# EAGLE design tick-wifi-mini-mk-1.0 (EAGLE 7.5.0)
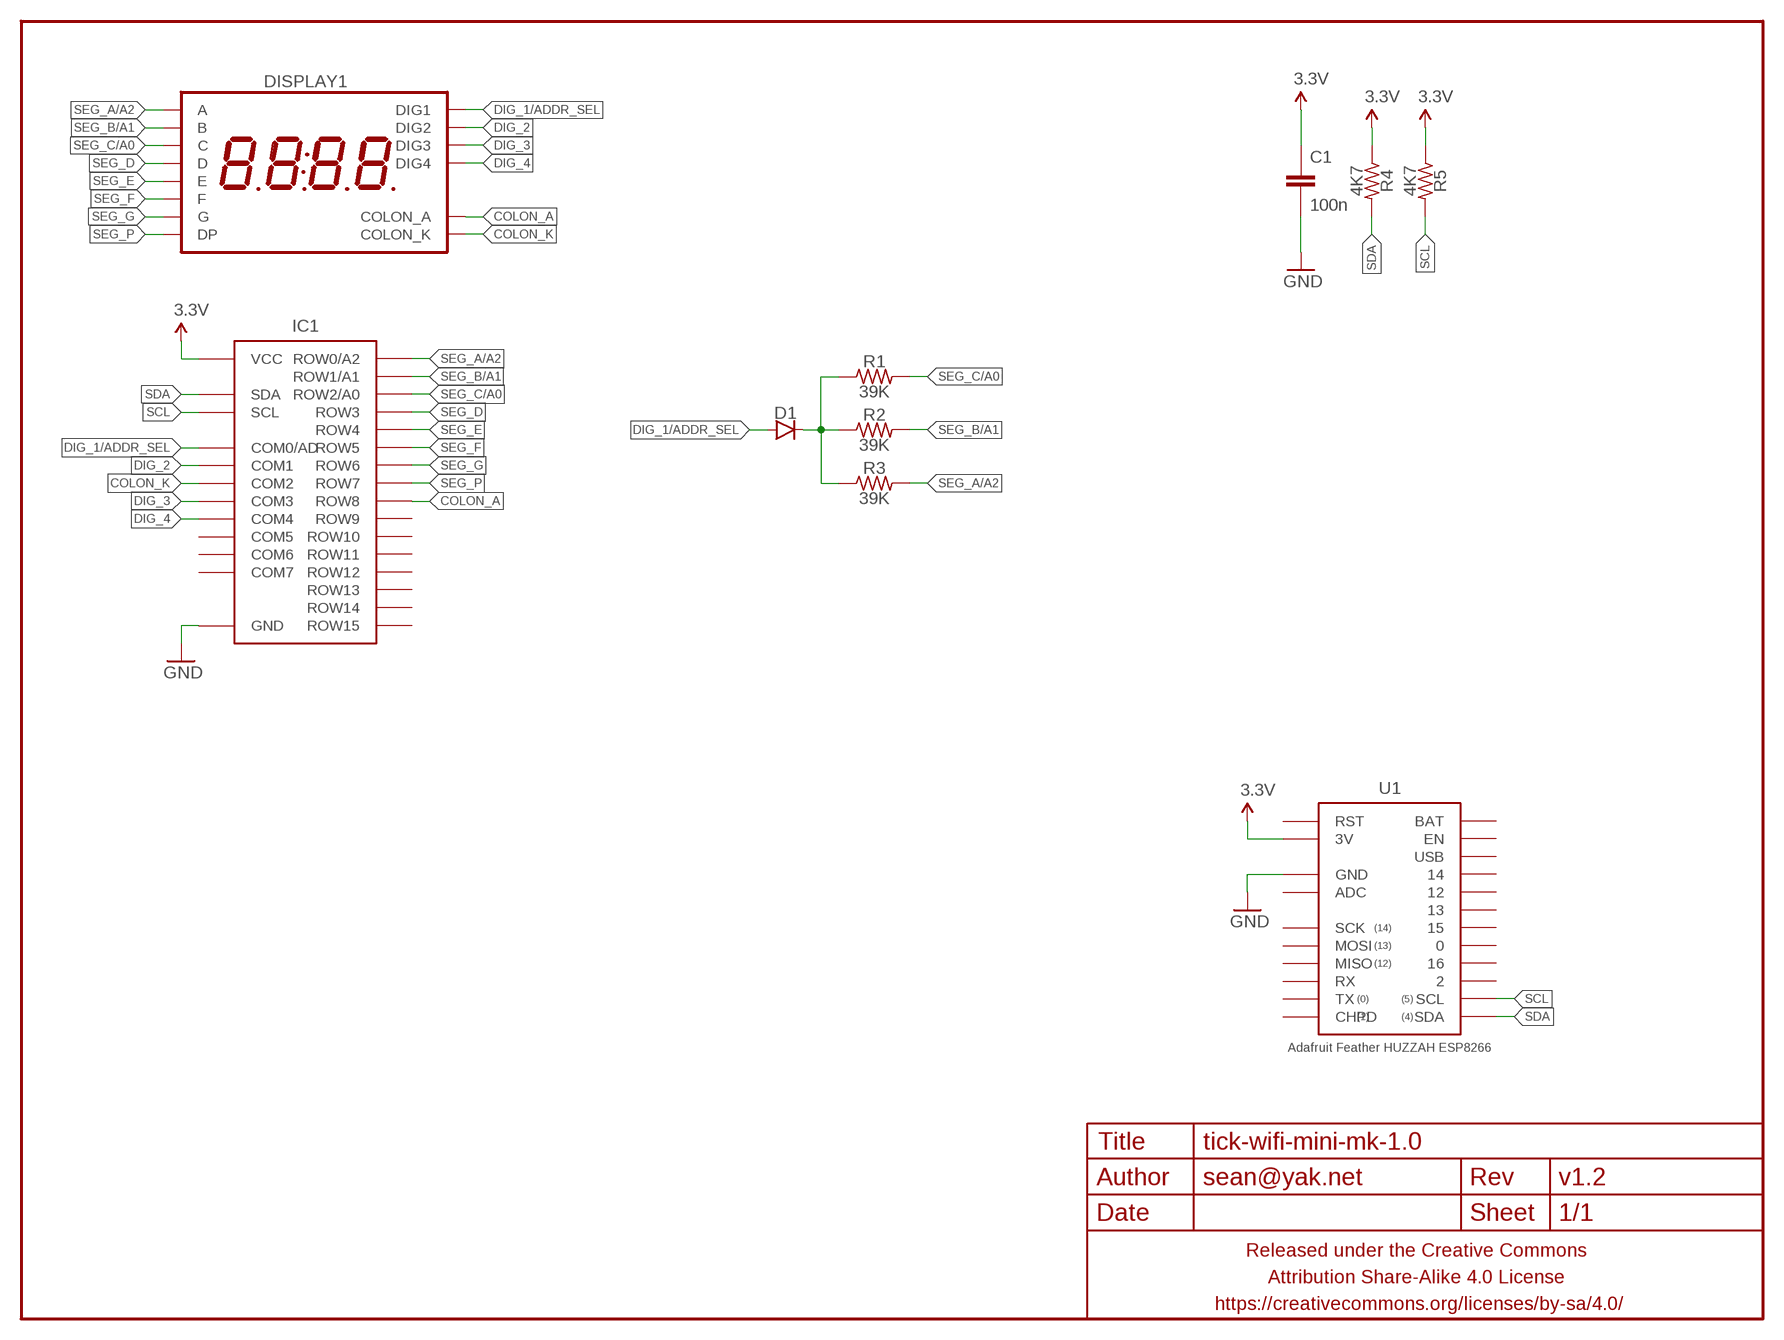
[diagram p0: schematic, sheet 1]

## Parts
C1  100n  CAPACITOR-CERAMICC0603  [C0603]
D1  DIODESOD123  [SOD123]
DISPLAY1  7SEG_4DIGIT_COLON14.2MM-CC  [7SEG_4DIG_0.56IN_14MM_ADAFRUIT]
FRAME1  FRAME-LETTERNO_PACKAGE  [DUMMY]
IC1  HT16K33  HT16K33-28SOIC28W  [SOIC28W]
R1  39K  RESISTORR0603  [R0603]
R2  39K  RESISTORR0603  [R0603]
R3  39K  RESISTORR0603  [R0603]
R4  4K7  RESISTORR0603  [R0603]
R5  4K7  RESISTORR0603  [R0603]
U1  Adafruit Feather HUZZAH ESP8266  ADAFRUIT_FEATHER_HUZZAH_ESP8266NOSILK  [ADAFRUIT_FEATHER_HUZZAH_NOSILK]

## Nets
3.3V: C1.1 IC1.28(VCC) R4.1 R5.1 U1.3V
COLON_A: DISPLAY1.P$8(COLON_A) IC1.17(ROW8)
COLON_K: DISPLAY1.P$7(COLON_K) IC1.4(COM2)
DIG_1/ADDR_SEL: D1.A DISPLAY1.P$14(DIG1) IC1.2(COM0/AD)
DIG_2: DISPLAY1.P$11(DIG2) IC1.3(COM1)
DIG_3: DISPLAY1.P$10(DIG3) IC1.5(COM3)
DIG_4: DISPLAY1.P$6(DIG4) IC1.6(COM4)
GND: C1.2 IC1.1(GND) U1.GND@0(GND)
N$1: D1.C R1.1 R2.1 R3.1
SCL: IC1.26(SCL) R5.2 U1.SCL
SDA: IC1.27(SDA) R4.2 U1.SDA
SEG_A/A2: DISPLAY1.P$13(A) IC1.25(ROW0/A2) R3.2
SEG_B/A1: DISPLAY1.P$9(B) IC1.24(ROW1/A1) R2.2
SEG_C/A0: DISPLAY1.P$4(C) IC1.23(ROW2/A0) R1.2
SEG_D: DISPLAY1.P$2(D) IC1.22(ROW3)
SEG_E: DISPLAY1.P$1(E) IC1.21(ROW4)
SEG_F: DISPLAY1.P$12(F) IC1.20(ROW5)
SEG_G: DISPLAY1.P$5(G) IC1.19(ROW6)
SEG_P: DISPLAY1.P$3(DP) IC1.18(ROW7)
Unconnected: IC1.7(COM5) IC1.8(COM6) IC1.9(COM7) IC1.10(ROW15) IC1.11(ROW14) IC1.12(ROW13) IC1.13(ROW12) IC1.14(ROW11) IC1.15(ROW10) IC1.16(ROW9) U1.0 U1.2 U1.12 U1.13 U1.14 U1.15 U1.16 U1.ADC U1.BAT U1.CHPD U1.EN U1.MISO U1.MOSI U1.RST U1.RX U1.SCK U1.TX U1.USB

## Library data of the parts
C1 = a_parts:CAPACITOR-CERAMIC: CAPACITOR, European symbol
D1 = a_parts:DIODE: Diode These are standard reverse protection diodes and small signal diodes. SMA package can handle up to about 1A. SOD-323 can handle about 200mA. What the SOD-323 package when ordering, there are some mfgs out there that are 5-pin packages.
DISPLAY1 = a_parts:7SEG_4DIGIT_COLON
FRAME1 = A_butts:FRAME-LETTER: Schematic Frame Standard 8.5x11 US Letter frame; DESIGNER: sean@yak.net; VERSION: v1.2
IC1 = a_parts:HT16K33-28
R1-R5 = a_parts:RESISTOR: RESISTOR, American symbol
U1 = a_parts:ADAFRUIT_FEATHER_HUZZAH_ESP8266

## Board
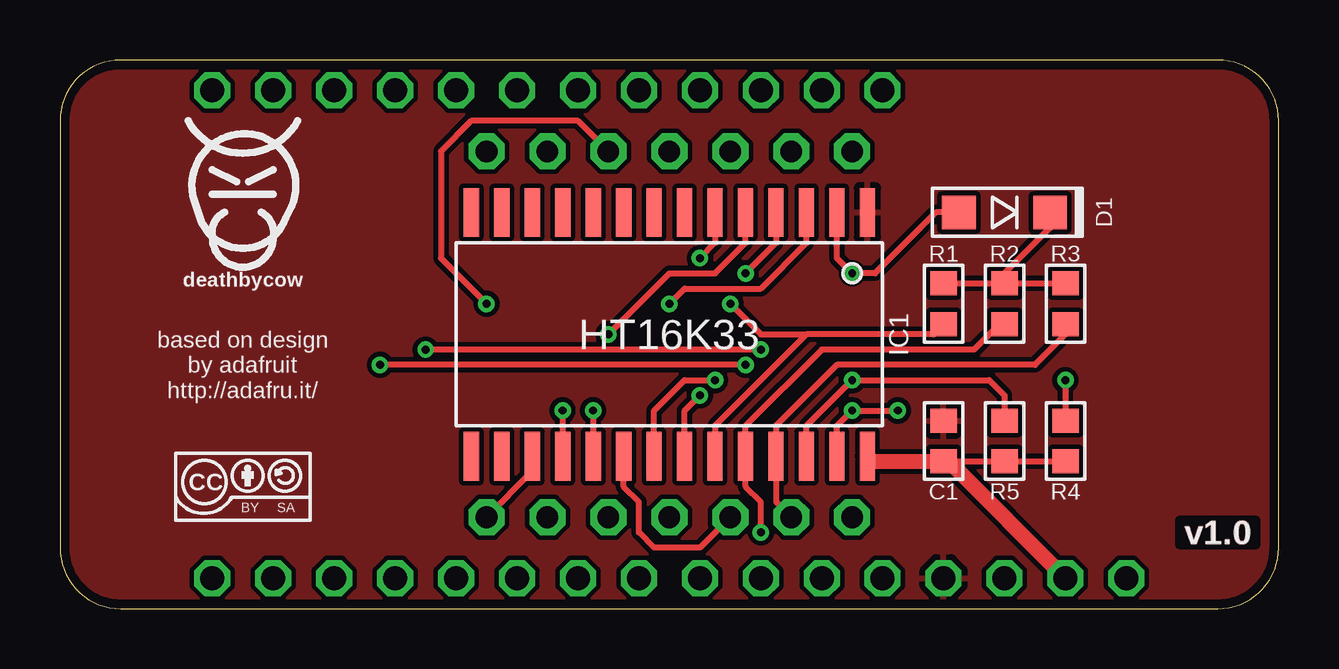
[diagram p1: board, top side]
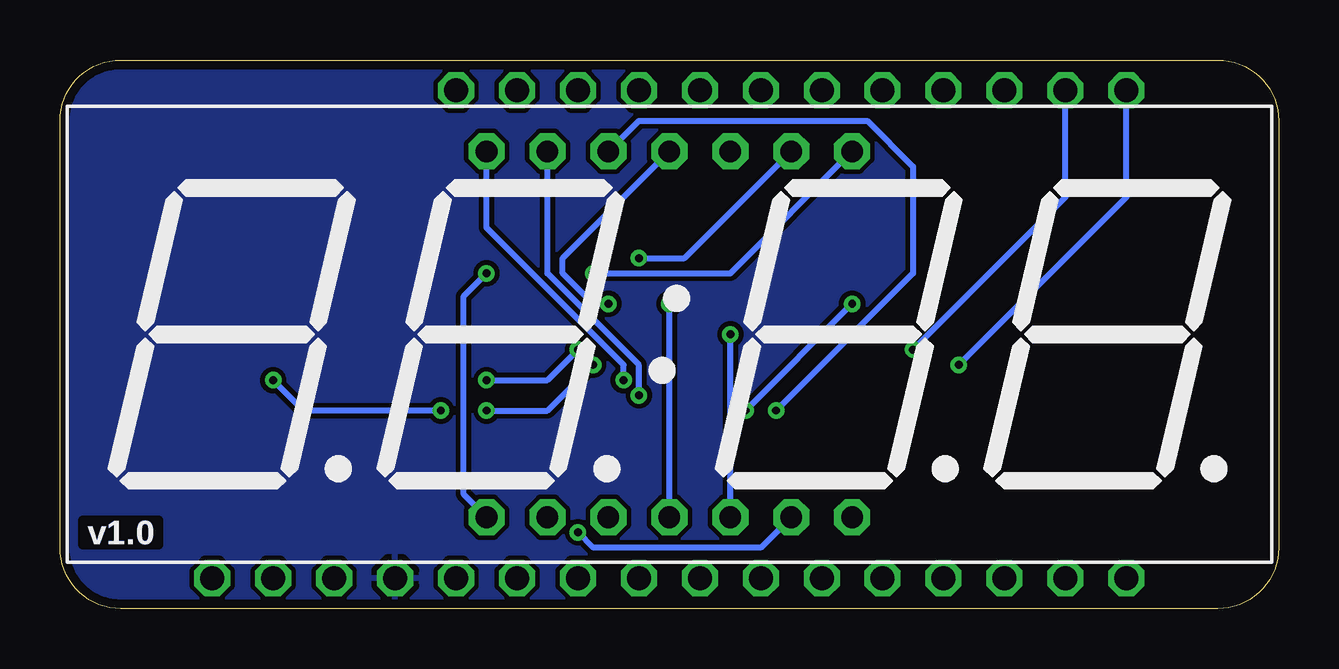
[diagram p2: board, bottom side, seen from below]

Size 50.8 x 22.86 mm. Coordinates in mm from the lower left corner, seen from the top.
Outline: 0,20.32 0,2.54 arc90 2.54,0 48.26,0 arc90 50.8,2.54 50.8,20.32 arc90 48.26,22.86 2.54,22.86 arc90 0,20.32
Copper layers (1*16): Top 0.0356mm / dielectric 1.5011mm / Bottom 0.0356mm
Design rules "LaenPCBOrder_2": minimum track width 6mil, minimum drill 13mil, track to track 6mil, track to pad 6mil, pad to pad 6mil, via to via 6mil, smd to smd 6mil, copper to edge 15mil, drill to drill 6mil, minimum pad ring 7mil, minimum via ring 7mil, stop-mask expansion 3mil, vias tented up to drill 20mil, thermal gap 10mil

### Footprints (pad centres in the part's own frame; a part is rotated, then mirrored left to right if it is on the bottom)
C0603 = smd 1 x 1.1: 1 -0.85,0; 2 0.85,0
SOD123 = smd 1.4 x 1.4: A 1.9,0; C -1.9,0
7SEG_4DIG_0.56IN_14MM_ADAFRUIT = drill 0.9 pad 1.5 octagon: P$1 -7.62,7.62; P$2 -5.08,7.62; P$3 -2.54,7.62; P$4 0,7.62; P$5 2.54,7.62; P$6 5.08,7.62; P$7 7.62,7.62; P$8 7.62,-7.62; P$9 5.08,-7.62; P$10 2.54,-7.62; P$11 0,-7.62; P$12 -2.54,-7.62; P$13 -5.08,-7.62; P$14 -7.62,-7.62
SOIC28W = smd 0.635 x 2.032: 1 -8.255,-5.08; 2 -6.985,-5.08; 3 -5.715,-5.08; 4 -4.445,-5.08; 5 -3.175,-5.08; 6 -1.905,-5.08; 7 -0.635,-5.08; 8 0.635,-5.08; 9 1.905,-5.08; 10 3.175,-5.08; 11 4.445,-5.08; 12 5.715,-5.08; 13 6.985,-5.08; 14 8.255,-5.08; 15 8.255,5.08; 16 6.985,5.08; 17 5.715,5.08; 18 4.445,5.08; 19 3.175,5.08; 20 1.905,5.08; 21 0.635,5.08; 22 -0.635,5.08; 23 -1.905,5.08; 24 -3.175,5.08; 25 -4.445,5.08; 26 -5.715,5.08; 27 -6.985,5.08; 28 -8.255,5.08
R0603 = smd 1 x 1.1: 1 -0.85,0; 2 0.85,0
ADAFRUIT_FEATHER_HUZZAH_NOSILK = drill 1 pad 1.5 octagon: 0 8.89,10.16; 2 13.97,10.16; 3V -16.51,-10.16; 12 1.27,10.16; 13 3.81,10.16; 14 -1.27,10.16; 15 6.35,10.16; 16 11.43,10.16; ADC -8.89,-10.16; BAT -8.89,10.16; CHPD 19.05,-10.16; EN -6.35,10.16; GND@0 -11.43,-10.16; MISO 11.43,-10.16; MOSI 8.89,-10.16; NC@3 -13.97,-10.16; NC@6 -6.35,-10.16; NC@7 -3.81,-10.16; NC@8 -1.27,-10.16; NC@9 1.27,-10.16; NC@10 3.81,-10.16; RST -19.05,-10.16; RX 13.97,-10.16; SCK 6.35,-10.16; SCL 16.51,10.16; SDA 19.05,10.16; TX 16.51,-10.16; USB -3.81,10.16

### Placement (x,y rotation side)
C1  36.83,6.99 90 top
D1  39.37,16.51 180 top
DISPLAY1  25.4,11.43 0 bottom
FRAME1  0,0 0 top
IC1  25.4,11.43 180 top
R1  36.83,12.7 270 top
R2  39.37,12.7 270 top
R3  41.91,12.7 270 top
R4  41.91,6.99 90 top
R5  39.37,6.99 90 top
U1  25.4,11.43 0 bottom
U$2  [COW_SMALL]  7.62,17.78 0 top
U$4  [CC-BY-SA-4.0-NO-URL]  7.62,5.08 0 top

### Tracks (layer width: path | path; a pad name or v marks a point on that pad's centre or on a via)
3.3V
  Top 0.254: 37.05,6.13 R5.1 R4.1
  Top 0.635: IC1.28 33.87,6.13 C1.1 37.05,6.13 U1.3V
COLON_A
  Top 0.254: IC1.17 19.68,5.71 DISPLAY1.P$8
COLON_K  (via drill 0.33)
  Top 0.254: IC1.4 29.84,15.24 v28.57,13.97
  Bottom 0.254: v28.57,13.97 22.86,13.97 DISPLAY1.P$7
DIG_1/ADDR_SEL  (via drill 0.33)
  Top 0.254: IC1.2 32.38,14.61 v33.02,13.97 33.97,13.97 36.51,16.51 D1.A
  Bottom 0.254: DISPLAY1.P$14 33.97,4.76 33.97,13.02 v33.02,13.97
DIG_2  (via drill 0.33)
  Top 0.254: v25.4,12.7 26.04,13.34 29.21,13.34 31.11,15.24 IC1.3
  Bottom 0.254: DISPLAY1.P$11 v25.4,12.7
DIG_3  (via drill 0.33)
  Top 0.254: v22.86,11.43 25.4,13.97 27.3,13.97 28.57,15.24 IC1.5
  Bottom 0.254: DISPLAY1.P$10 v22.86,11.43
DIG_4  (via drill 0.33)
  Top 0.254: IC1.6 27.3,15.24 v26.67,14.61
  Bottom 0.254: v26.67,14.61 24.77,14.61 DISPLAY1.P$6
GND
  pour Top (isolate 0.2): 48.26,0 2.54,0 arc-90 0,2.54 0,20.32 arc-90 2.54,22.86 48.26,22.86 arc-90 50.8,20.32 50.8,2.54 arc-90
  pour Bottom (isolate 0.2): 48.26,0 2.54,0 arc-90 0,2.54 0,20.32 arc-90 2.54,22.86 48.26,22.86 arc-90 50.8,20.32 50.8,2.54 arc-90
N$1
  Top 0.254: R1.1 R2.1 | R2.1 R3.1 | D1.C 41.27,15.87 39.37,13.97 R2.1
SCL  (via drill 0.33)
  Top 0.254: IC1.26 31.11,7.62 v33.02,9.53 38.73,9.53 39.37,8.89 R5.2 | v29.21,10.79 v15.24,10.79
  Bottom 0.254: v33.02,9.53 30.48,9.53 v29.21,10.79 | v15.24,10.79 8.89,17.14 U1.SCL
SDA  (via drill 0.33)
  Top 0.254: IC1.27 32.38,7.62 v33.02,8.26 v34.92,8.26 | v41.91,9.53 R4.2 | v28.57,10.16 v13.34,10.16
  Bottom 0.254: v34.92,8.26 40.64,8.26 v41.91,9.53 | v13.34,10.16 6.35,17.14 U1.SDA | v33.02,8.26 30.48,8.26 v28.57,10.16
SEG_A/A2
  Top 0.254: R3.2 41.91,11.43 40.64,10.16 32.38,10.16 29.84,7.62 IC1.25 29.84,4.45 DISPLAY1.P$13
SEG_B/A1  (via drill 0.33)
  Top 0.254: R2.2 39.16,11.85 38.1,10.79 31.75,10.79 28.57,7.62 IC1.24 28.57,5.08 29.21,4.45 v29.21,3.17
  Bottom 0.254: DISPLAY1.P$9 21.59,2.54 28.57,2.54 v29.21,3.17
SEG_C/A0  (via drill 0.33)
  Top 0.254: R1.2 36.41,11.43 31.11,11.43 | 31.11,11.43 27.3,7.62 IC1.23 | v27.94,12.7 29.21,11.43 31.11,11.43
  Bottom 0.254: v27.94,12.7 28.57,12.7 29.84,13.97 29.84,14.61 DISPLAY1.P$4
SEG_D  (via drill 0.33)
  Top 0.254: IC1.22 26.04,8.26 v26.67,8.89
  Bottom 0.254: v26.67,8.89 26.67,10.16 30.48,13.97 DISPLAY1.P$2
SEG_E  (via drill 0.33)
  Top 0.254: IC1.21 24.77,8.26 26.04,9.53 v27.3,9.53
  Bottom 0.254: v27.3,9.53 27.3,10.16 33.02,15.88 DISPLAY1.P$1
SEG_F
  Top 0.254: DISPLAY1.P$12 26.67,2.54 24.77,2.54 24.13,3.17 24.13,4.45 23.5,5.08 IC1.20
SEG_G  (via drill 0.33)
  Top 0.254: DISPLAY1.P$5 21.59,20.32 17.14,20.32 15.88,19.05 15.88,14.61 v17.78,12.7 | v22.23,8.26 IC1.19
  Bottom 0.254: v17.78,12.7 v22.23,8.26
SEG_P  (via drill 0.33)
  Top 0.254: v20.95,8.26 IC1.18
  Bottom 0.254: DISPLAY1.P$3 26.67,20.32 17.14,20.32 15.24,18.41 15.24,13.97 v20.95,8.26

### Text on the board
tPlace: based on design / by adafruit / http://adafru.it/